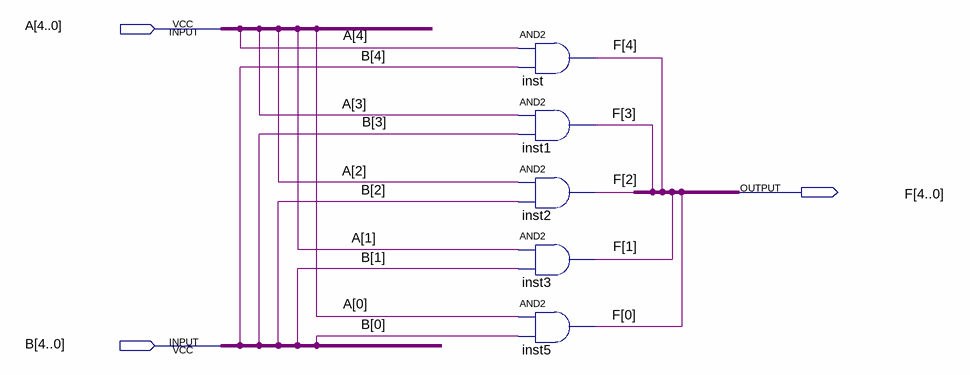
[diagram p0: schematic sheet]
// Quartus schematic Fand.bdf as structural Verilog: 5 symbols, 3 pins
module Fand (
  input  [4:0] A,
  input  [4:0] B,
  output [4:0] F
);

  and inst (F[4], A[4], B[4]);
  and inst1 (F[3], A[3], B[3]);
  and inst2 (F[2], A[2], B[2]);
  and inst3 (F[1], A[1], B[1]);
  and inst5 (F[0], A[0], B[0]);
endmodule
